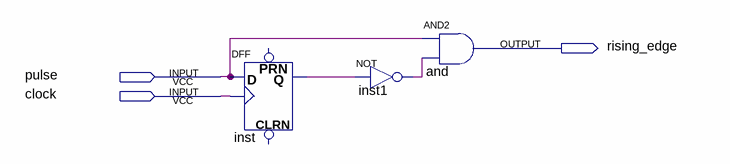
[diagram p0: schematic sheet]
// Quartus schematic edge_identifier.bdf as structural Verilog: 3 symbols, 3 pins
module edge_identifier (
  input  pulse,
  input  clock,
  output rising_edge
);

  wire inst1_out, inst_q;

  DFF inst (.CLK(clock), .D(pulse), .Q(inst_q));  // open: CLRN, PRN
  and \and  (rising_edge, pulse, inst1_out);
  not inst1 (inst1_out, inst_q);
endmodule
